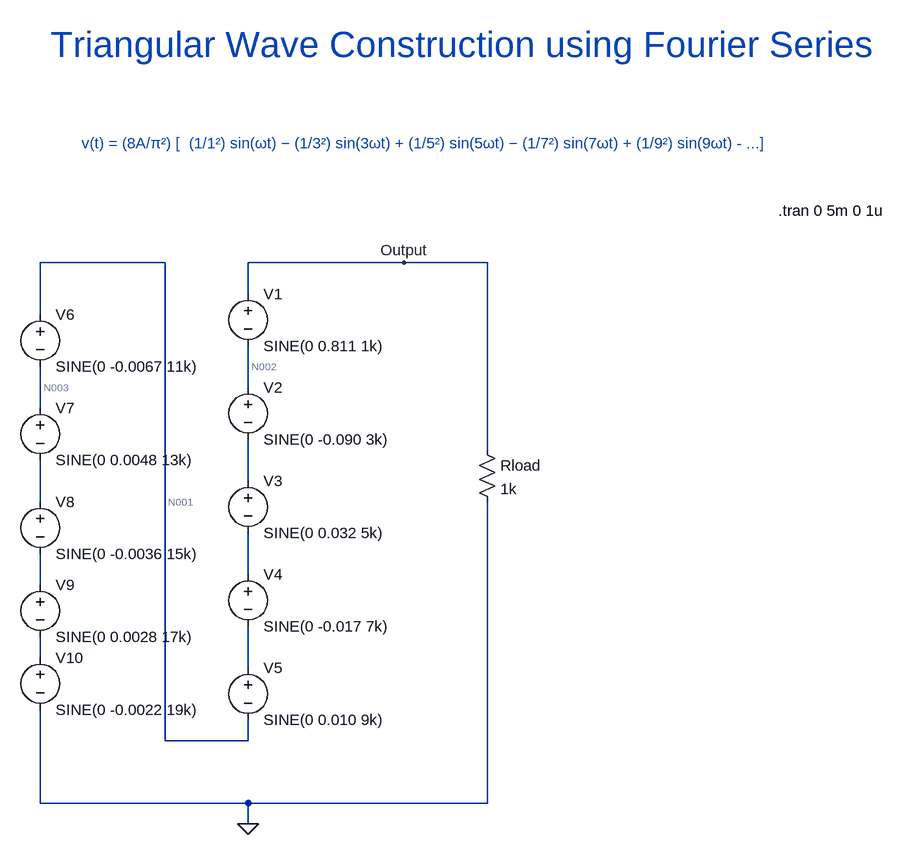
[diagram p0: schematic Triangular_wave_gen_fourier_series.asc]
Triangular_wave_gen_fourier_series.asc, the LTspice schematic file:
Version 4
SHEET 1 1308 1696
WIRE 64 320 -128 320
WIRE 432 320 192 320
WIRE 560 320 432 320
WIRE 192 368 192 320
WIRE -128 400 -128 320
WIRE 192 512 192 448
WIRE -128 544 -128 480
WIRE 560 608 560 320
WIRE 192 656 192 592
WIRE -128 688 -128 624
WIRE 192 800 192 736
WIRE -128 816 -128 768
WIRE -128 928 -128 896
WIRE 192 944 192 880
WIRE 64 1056 64 320
WIRE 192 1056 192 1024
WIRE 192 1056 64 1056
WIRE -128 1152 -128 1008
WIRE 192 1152 -128 1152
WIRE 560 1152 560 688
WIRE 560 1152 192 1152
WIRE 192 1184 192 1152
FLAG 192 1184 0
FLAG 432 320 Output
SYMBOL voltage 192 352 R0
WINDOW 123 0 0 Left 0
WINDOW 39 0 0 Left 0
SYMATTR InstName V1
SYMATTR Value SINE(0 0.811 1k)
SYMBOL voltage 192 496 R0
WINDOW 123 0 0 Left 0
WINDOW 39 0 0 Left 0
SYMATTR InstName V2
SYMATTR Value SINE(0 -0.090 3k)
SYMBOL voltage 192 640 R0
WINDOW 123 0 0 Left 0
WINDOW 39 0 0 Left 0
SYMATTR InstName V3
SYMATTR Value SINE(0 0.032 5k)
SYMBOL voltage 192 784 R0
WINDOW 123 0 0 Left 0
WINDOW 39 0 0 Left 0
SYMATTR InstName V4
SYMATTR Value SINE(0 -0.017 7k)
SYMBOL voltage 192 928 R0
WINDOW 123 0 0 Left 0
WINDOW 39 0 0 Left 0
SYMATTR InstName V5
SYMATTR Value SINE(0 0.010 9k)
SYMBOL voltage -128 384 R0
WINDOW 123 0 0 Left 0
WINDOW 39 0 0 Left 0
SYMATTR InstName V6
SYMATTR Value SINE(0 -0.0067 11k)
SYMBOL voltage -128 528 R0
WINDOW 123 0 0 Left 0
WINDOW 39 0 0 Left 0
SYMATTR InstName V7
SYMATTR Value SINE(0 0.0048 13k)
SYMBOL voltage -128 672 R0
WINDOW 123 0 0 Left 0
WINDOW 39 0 0 Left 0
SYMATTR InstName V8
SYMATTR Value SINE(0 -0.0036 15k)
SYMBOL voltage -128 800 R0
WINDOW 123 0 0 Left 0
WINDOW 39 0 0 Left 0
SYMATTR InstName V9
SYMATTR Value SINE(0 0.0028 17k)
SYMBOL voltage -128 912 R0
WINDOW 123 0 0 Left 0
WINDOW 39 0 0 Left 0
SYMATTR InstName V10
SYMATTR Value SINE(0 -0.0022 19k)
SYMBOL res 544 592 R0
SYMATTR InstName Rload
SYMATTR Value 1k
TEXT -112 -16 Left 5 ;Triangular Wave Construction using Fourier Series
TEXT -64 136 Left 2 ;v(t) = (8A/π²) [  (1/1²) sin(ωt) − (1/3²) sin(3ωt) + (1/5²) sin(5ωt) − (1/7²) sin(7ωt) + (1/9²) sin(9ωt) - ...]
TEXT 1008 240 Left 2 !.tran 0 5m 0 1u

The netlist it stands for:
* Triangular_wave_gen_fourier_series.asc
V1 Output N002 SINE(0 0.811 1k)
V2 N002 N004 SINE(0 -0.090 3k)
V3 N004 N006 SINE(0 0.032 5k)
V4 N006 N009 SINE(0 -0.017 7k)
V5 N009 N001 SINE(0 0.010 9k)
V6 N001 N003 SINE(0 -0.0067 11k)
V7 N003 N005 SINE(0 0.0048 13k)
V8 N005 N007 SINE(0 -0.0036 15k)
V9 N007 N008 SINE(0 0.0028 17k)
V10 N008 0 SINE(0 -0.0022 19k)
Rload Output 0 1k
* Triangular Wave Construction using Fourier Series
* v(t) = (8A/π²) [  (1/1²) sin(ωt) − (1/3²) sin(3ωt) + (1/5²) sin(5ωt) − (1/7²) sin(7ωt) + (1/9²) sin(9ωt) - ...]
.tran 0 5m 0 1u
.backanno
.end

* Results of the author's LTspice run, read from the files saved beside the schematic
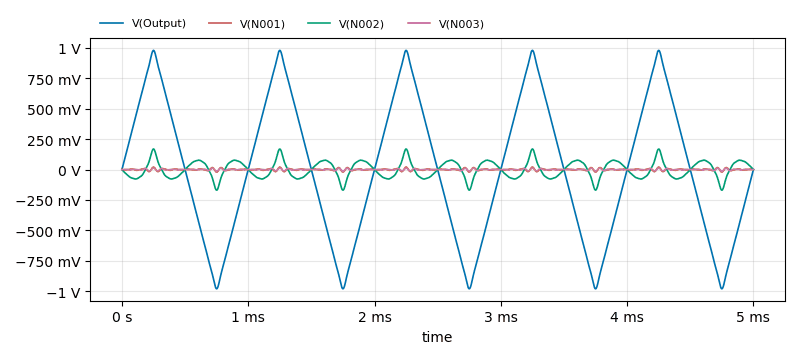
[diagram p1: Transient Analysis of Triangular_wave_gen_fourier_series.asc, plotted from the saved traces]
* Transient Analysis, 1 run:
*   V(Output): min -980.1 mV, max 980.1 mV, average 0 V, rms 577.6 mV, last 0 V
*   V(N001): min -20.1 mV, max 20.1 mV, average 7.91 nV, rms 6.843 mV, last 0 V
*   V(N002): min -169.1 mV, max 169.1 mV, average 0 V, rms 69.31 mV, last 0 V
*   V(N003): min -13.4 mV, max 13.4 mV, average 27.38 nV, rms 4.937 mV, last 0 V